# Altium project Dimmer_WiFi.PrjPcb
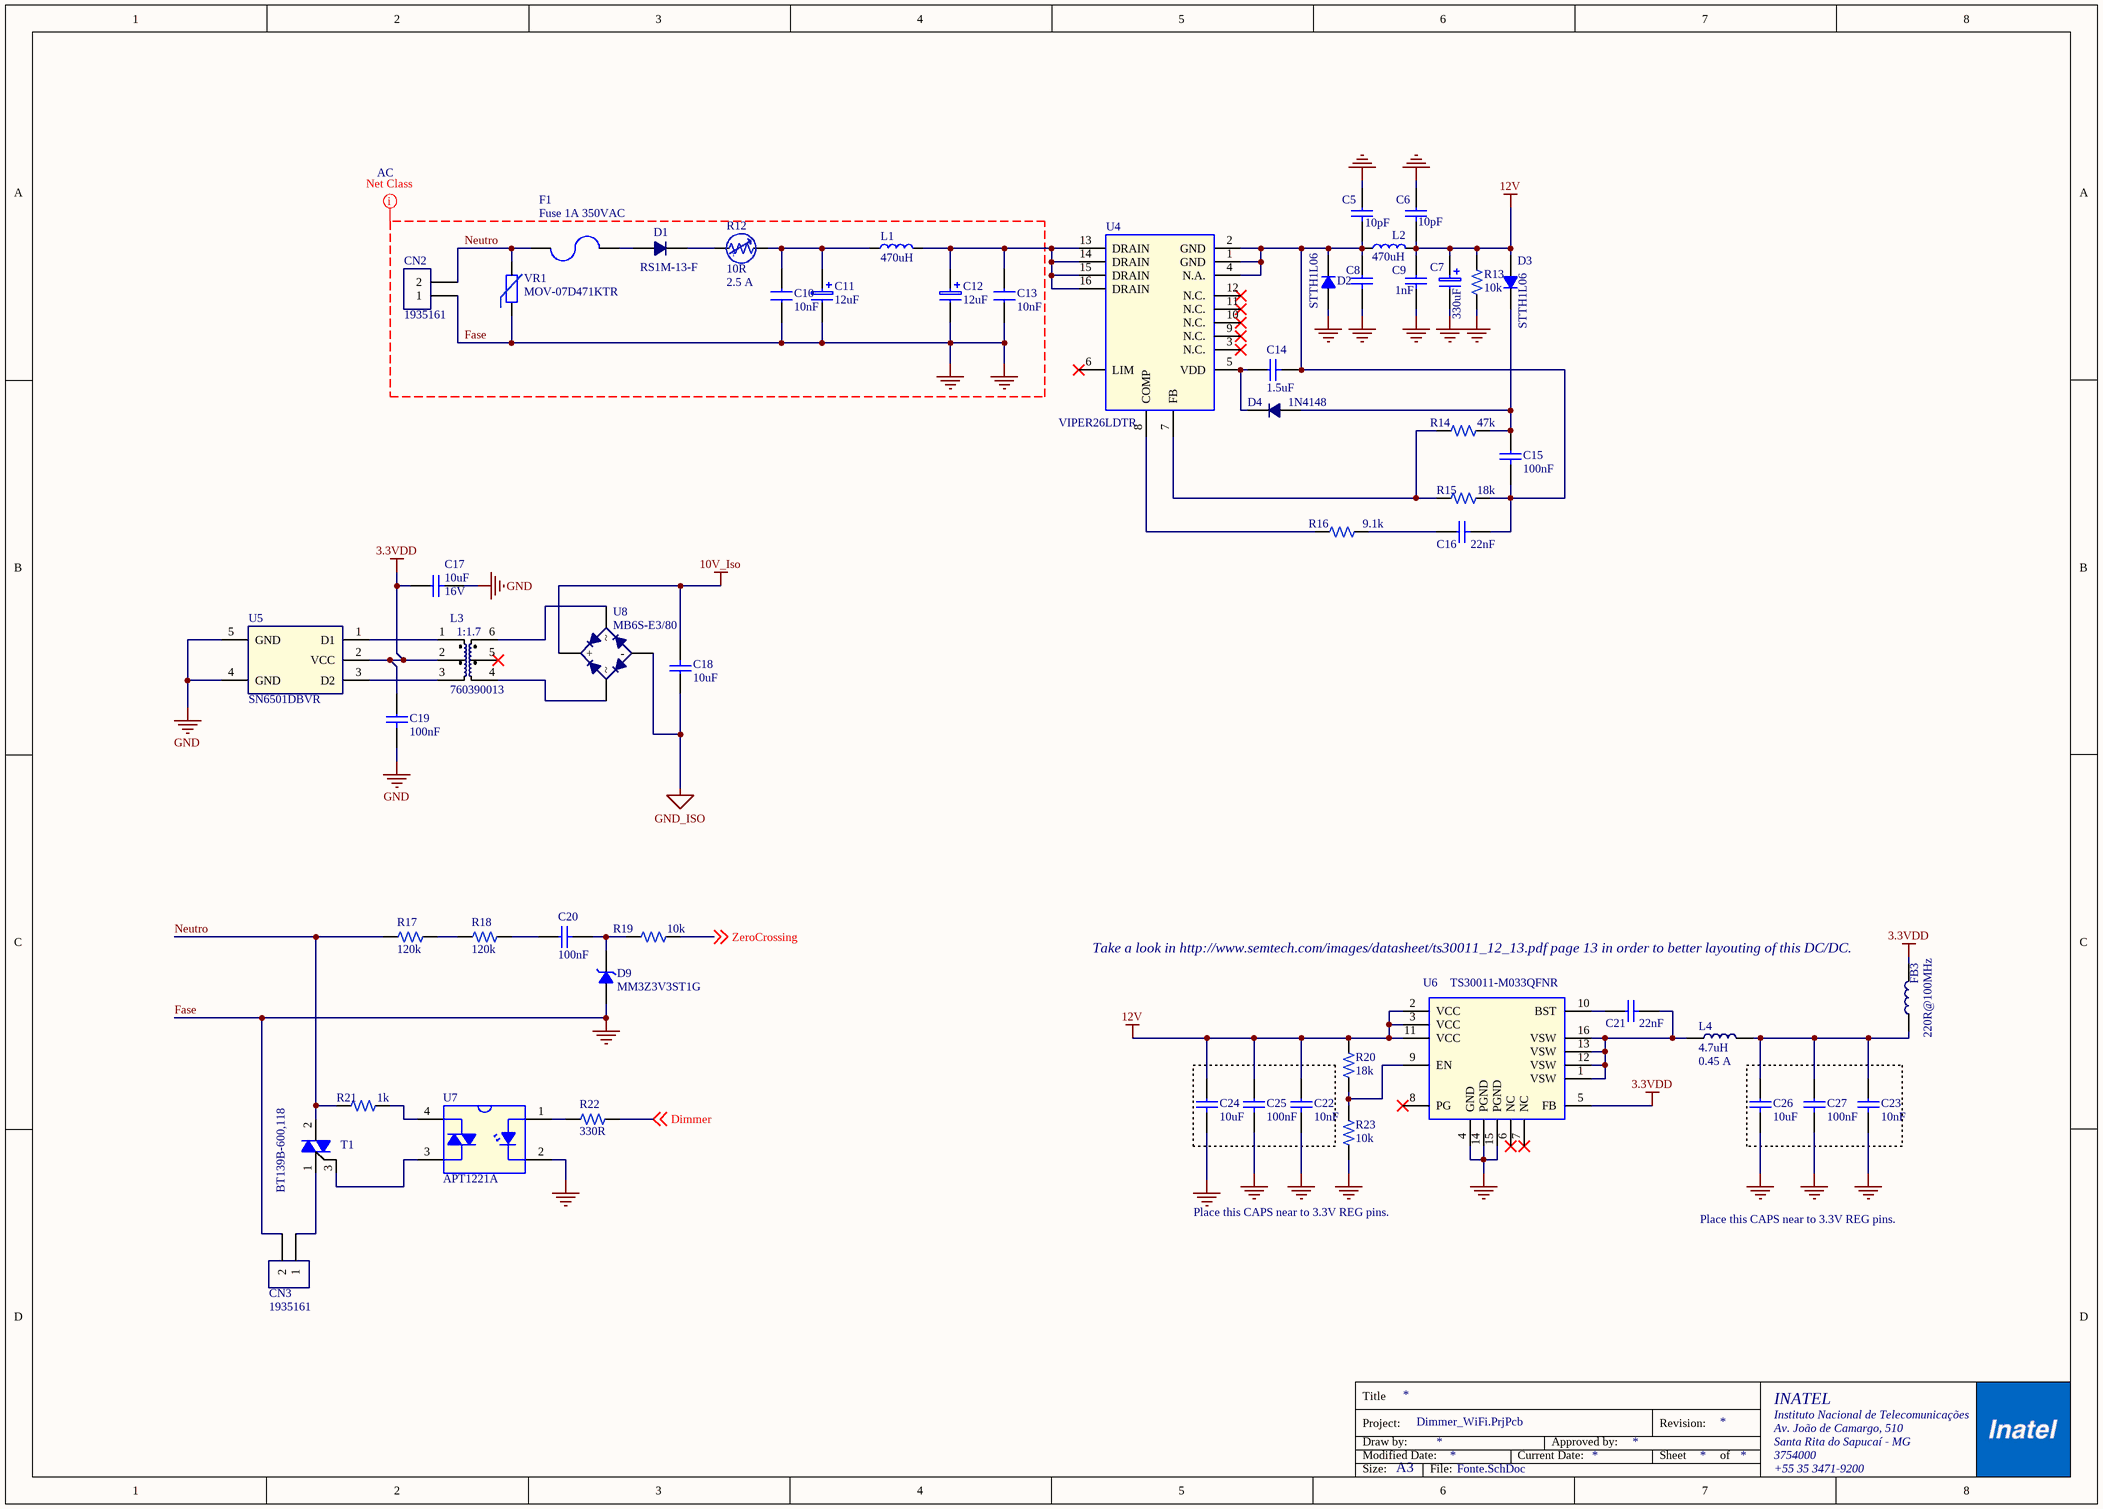
[diagram p0: Fonte.SchDoc]
3 sheets, 95 parts. Net scope: global (net labels, ports and power ports of the same name join across sheets).
Board file: Dimmer_WiFi.PcbDoc
Sheets:
  Fonte.SchDoc
  ESP8266.SchDoc
  DALI.SchDoc

## Sheet Fonte.SchDoc
size A3

### Parts
C5  10pF  [0603-3D]
C6  10pF  [0603-3D]
C7  330uF  [CAP-RADIAL-630Dx1500Hx250P-3D]
C8  1nF  [0603-3D]  (value not drawn)
C9  1nF  [0603-3D]
C10  value 10nF  [CAP-RADIAL-5mm]  (hidden comment: CAP FILM 10000PF 5% 630VDC RAD)
C11  12uF  [CAP-RADIAL-1000Dx1750Hx500P-3D]
C12  12uF  [CAP-RADIAL-1000Dx1750Hx500P-3D]
C13  value 10nF  [CAP-RADIAL-5mm]  (hidden comment: CAP FILM 10000PF 5% 630VDC RAD)
C14  1.5uF  [1206-Ceramic-3D]
C15  100nF  [0603-3D]
C16  22nF  [0603-3D]
C17  Voltage: 16V  [CAP-0603-3D]  (hidden comment: 10uF)
C18  10uF  [CAP-0603-3D]
C19  100nF  [0603-3D]
C20  100nF  [0603-3D]
C21  22nF  [0603-3D]
C22  10nF  [0603-3D]
C23  10nF  [0603-3D]
C24  10uF  [CAP-0603-3D]
C25  100nF  [0603-3D]
C26  10uF  [CAP-0603-3D]
C27  100nF  [0603-3D]
CN2  1935161  [TERM BLOCK PCB 2POS 5.0MM]
CN3  1935161  [TERM BLOCK PCB 2POS 5.0MM]
D1  value RS1M-13-F  [DO-214AC_SMA-3D]  (hidden comment: DIODE GEN PURP 1KV 1A SMA)
D2  STTH1L06  [DO-214AC_SMA-3D]
D3  STTH1L06  [DO-214AC_SMA-3D]
D4  1N4148  [SOD323-3D]
D9  MM3Z3V3ST1G  [SOD323-3D]
F1  Fuse 1A 350VAC  [Fuse-SMD-610L254W279H-3D]
FB3  220R@100MHz  [IND-0603-3D]
L1  470uH  [IND_620W590L450H_CLF6045]
L2  470uH  [IND_620W590L450H_CLF6045]
L3  value 760390013  [TRAFO-DC/DC-CONVERTERS-3D]  (hidden comment: TRANSFORMER 475UH SMD)
L4  value 4.7uH  Current Rating: 0.45 A  [IND-1210-PWR-3D]  (hidden comment: FIXED IND 4.7UH 450MA 200 MOHM)
R12  Current: 2.5 A  [NTC-800D500W-500P-3D]  (hidden comment: 10R)
R13  10k  [0603-3D]
R14  47k  [0603-3D]
R15  18k  [0603-3D]
R16  9.1k  [0603-3D]
R17  120k  [RES-1206-3D]
R18  120k  [RES-1206-3D]
R19  10k  [0603-3D]
R20  18k  [0603-3D]
R21  1k  [0805-3D]
R22  value 330R  [0603-3D]  (hidden comment: RES SMD 330 OHM 5% 1/10W 0603)
R23  10k  [0603-3D]
T1  value BT139B-600,118  [D2PAC-3D]  (hidden comment: TRIAC 600V 16A D2PAK)
U4  VIPER26LDTR  [SO16N-3D]
U5  value SN6501DBVR  [SOT23-5]  (hidden comment: IC REG CONV PWR SUPPLIES SOT23-5)
U6  TS30011-M033QFNR  [16VQFN-3D]
U7  APT1221A  [DIP4-SMD]
U8  value MB6S-E3/80  [TO-269AA-3D]  (hidden comment: Bridge Rectifier Single Phase 600V 500mA Surface Mount TO-269AA (MBS))
VR1  MOV-07D471KTR  [VAR-05D-SERIES-PTH-3D]

### Nets
3.3VDD: C17.1 C19.1 FB3.2 L3.2 U5.2(VCC) U6.5(FB)
10V_Iso: C18.2 U8.3(+)
12V: C6.2 C7.1 C9.1 C22.1 C24.1 C25.1 D3.1 L2.2 R13.2 R20.2 U6.2(VCC) U6.3(VCC) U6.11(VCC)
Fase: C5.1 C6.1 C7.2 C8.2 C9.2 C10.2 C11.2 C12.2 C13.2 C17.2 C19.2 C22.2 C23.2 C24.2 C25.2 C26.2 C27.2 CN2.1 CN3.2 D2.1 D9.1 R13.1 R23.1 U5.4(GND) U5.5(GND) U6.4(GND) U6.14(PGND) U6.15(PGND) U7.2(K) VR1.1  [also labelled GND]
GND_ISO: C18.1 U8.4(-)
Dimmer: R22.2 ; off-sheet Dimmer
Neutro: CN2.2 F1.2 R17.1 R21.2 T1.2(T2) VR1.2
ZeroCrossing: R19.2 ; off-sheet ZeroCrossing
NetC5_2: C5.2 C8.1 C14.2 C15.2 C16.2 D2.2 L2.1 R15.2 U4.1(GND) U4.2(GND) U4.4(N.A.)
NetC10_1: C10.1 C11.1 L1.1 R12.2
NetC12_1: C12.1 C13.1 L1.2 U4.13(DRAIN) U4.14(DRAIN) U4.15(DRAIN) U4.16(DRAIN)
NetC14_1: C14.1 D4.2 U4.5(VDD)
NetC15_1: C15.1 D3.2 D4.1 R14.2
NetC16_1: C16.1 R16.2
NetC20_1: C20.1 R18.2
NetC20_2: C20.2 D9.2 R19.1
NetC21_1: C21.1 U6.10(BST)
NetC21_2: C21.2 L4.1 U6.1(VSW) U6.12(VSW) U6.13(VSW) U6.16(VSW)
NetC23_1: C23.1 C26.1 C27.1 FB3.1 L4.2
NetCN3_1: CN3.1 T1.1(T1)
NetD1_1: D1.1 F1.1
NetD1_2: D1.2 R12.1
NetL3_1: L3.1 U5.1(D1)
NetL3_3: L3.3 U5.3(D2)
NetL3_4: L3.4 U8.1
NetL3_6: L3.6 U8.2
NetR14_1: R14.1 R15.1 U4.7(FB)
NetR16_1: R16.1 U4.8(COMP)
NetR17_2: R17.2 R18.1
NetR20_1: R20.1 R23.2 U6.9(EN)
NetR21_1: R21.1 U7.4(T2)
NetR22_1: R22.1 U7.1(A)
NetT1_3: T1.3(G) U7.3(MT2)

Not connected (* = marked no-connect by the designer): L3 5*; U4 3(N.C.)* 6(LIM)* 9(N.C.)* 10(N.C.)* 11(N.C.)* 12(N.C.)*; U6 6(NC)* 7(NC)* 8(PG)*

### Layout directives
net class AC: (no net found under the mark)

### Notes on the sheet
- (near FB3) Take a look in http://www.semtech.com/images/datasheet/ts30011_12_13.pdf page 13 in order to better layouting of this DC/DC.
- Place this CAPS near to 3.3V REG pins.
- Title
- Modified Date:
- Project:
- Draw by:
- Current Date:
- Approved by:
- Sheet
- Revision:
- of
- Instituto Nacional de Telecomunicações
- Av. João de Camargo, 510
- Santa Rita do Sapucaí - MG
- 3754000
- INATEL
- Size:
- A3
- File:
- +55 35 3471-9200
- (in symbol 760390013 TRANSFORMER 475UH SMD) 1:1.7
- (in symbol SL08 10002 NTC 10R 20% 2.5A 8MM) T

### Library data of the parts
C5 C6 = 10pF 1% 0603 MLCC NPO 50V: CAP CER 10PF 50V NP0 0603; User: Rodrigo Villela; Code: *; Creation Date: 2015/12/01; Version: V01; Size: 0603; Voltage: 50V; Supplier 1: Digi-Key; Value: 10pF; Supplier Part Number 1: 1276-2152-1-ND
C7 = 330uF 20% RADIAL PTH 16V: CAP 330 UF 20% 16 V; User: Jean Pierre; Voltage: 16V; Code: *; Creation Date: 2016/07/08; Version: V01; Size: RADIAL, CAN - PTH; Supplier 1: Digi-Key; Supplier Part Number 1: 732-9474-1-ND; Value: 330uF
C8 C9 = 1000pF 5% 0603 MLCC NP0 50V: CAP CER 1000PF 50V 5% NP0 0603; User: Anderson Daniel Soares; Code: *; Creation Date: 2015/01/27; Version: V01; Supplier 1: Digi-Key; Supplier Part Number 1: 490-4768-1-ND; Voltage: 50V; Size: 0603; Value: 1nF
C10 C13 = 10nF 5% RADIAL FILM 400VAC: User: Ricardo Dias; Voltage: 400VAC; Code: *; Creation: 2016/02/19; Version: V01; Size: Radial; Supplier 1: Digi-Key; Supplier Part Number 1: 495-1262-ND
C11 C12 = 12uF 20% RADIAL PTH 350V: CAP ALUM 12UF 20% 350V RADIAL; User: Ricardo Dias; Code: *; Creation Date: 2016/06/08; Version: V01; Size: RADIAL, CAN - PTH; Voltage: 350V; Supplier 1: Digi-Key; Supplier Part Number 1: 565-3506-ND; Value: 12uF
C14 = 1.5uF 10% 1206 MLCC X7R 50V: CAP CER 1.5UF 50V X7R 1206; User: Ricardo Dias; Code: *; Creation Date: 2016/06/08; Version: V01; Size: 1206; Voltage: 50V; Supplier 1: Digi-Key; Supplier Part Number 1: 445-6985-1-ND; Value: 1.5uF
C15 = 0.1uF 10% 0603 MLCC X7R 50V KEMET: 0.1µF ±10% 50V Ceramic Capacitor X7R 0603 (1608 Metric); User: Ricardo Dias; Code: *; Creation Date: 2017/10/06; Version: V01; Size: 0603; Voltage: 50V; Supplier 1: Digi-Key; Supplier 2: Mouser; Supplier 3: Newark; Supplier Part Number 1: 399-5089-1-ND; Supplier Part Number 2: 80-C0603C104K5R; Supplier Part Number 3: 72J5992; Value: 100nF
C16 C21 = 0.022uF 20% 0603 MLCC X7R 16V: 0.022µF 16V Ceramic Capacitor X7R 0603; User: Jean Pierre; Code: *; Creation Date: 2016/08/16; Supplier 1: Digi-Key; Supplier Part Number 1: 445-5115-1-ND; Size: 0603; Voltage: 16V; Value: 22nF
C17 C18 C24 C26 = 10uF 20% 0603 MLCC X5R 16V: CAP CER 10UF 16V 20% X5R 0603; User: Mateus Elias; Code: *; Creation Date: 2014/10/07; Supplier 1: Digi-Key; Supplier 2: Mouser; Supplier 3: Newark; Supplier Part Number 1: 490-7201-1-ND; Supplier Part Number 2: 963-EMK107BBJ106MA-T; Supplier Part Number 3: 68X2787; Version: V01; Size: 0603; Value: 10uF
  C18 C24 C26: Voltage: 16V
C19 C20 C25 C27 = 0.1uF 10% 0603 MLCC X7R 50V: CAP CER 0.1UF 50V 10% X7R 0603; User: Anderson Daniel Soares; Code: *; Creation Date: 2015/01/23; Version: V01; Supplier 1: Digi-Key; Supplier Part Number 1: 445-5666-6-ND; Supplier 2: Mouser; Supplier Part Number 2: 810-CGA3E2X7R1H104K; Supplier 3: Newark; Supplier Part Number 3: 04X3156; Size: 0603; Voltage: 50V; Value: 100nF
C22 C23 = 10000pF 10% 0603 MLCC X7R 50V KEMET: 10000pF ±10% 16V Ceramic Capacitor X7R 0603 (1608 Metric); User: Ricardo Dias; Voltage: 50V; Code: *; Creation Date: 2017/10/06; Version: V01; Size: 0603; Supplier 1: Digi-Key; Supplier 2: Mouser; Supplier Part Number 1: 399-7841-1-ND; Supplier Part Number 2: 80-C0603C103K4R; Value: 10nF
CN2 CN3 = 1935161  TERM BLOCK PCB 2X1: TERM BLOCK PCB 2POS 5.0MM; User: Rodrigo Balbi; Code: *; Creation Date: 2015/11/30; Size: -; Version: V02; Supplier 1: Digikey; Supplier Part Number 1: 277-1667-ND; Supplier 2: Mouser; Supplier 3: Newarc; Supplier Part Number 2: 651-1935161; Supplier Part Number 3: 70R0063; Value: 1935161
D1 = RS1M-13-F DIODE GEN PURP 1KV 1A SMA: Manufacturer: Diodes Incorporated; User: Pedro Vilela; Size: DO-214AC, SMA; Code: *; Creation Date: 2018/09/28; Version: V03; Supplier 1: Digi-Key; Supplier 2: Mouser; Supplier 3: Newark; Supplier Part Number 2: 621-RS1M-13-F; Supplier Part Number 3: 23T8374; Supplier Part Number 1: RS1M-FDICT-ND; Manufacturer Part Number: RS1M-13-F; ComponentLink1Description: RS1M-FDICT-ND; ComponentLink1URL: https://www.digikey.com/products/en?keywords=RS1M-FDICT-ND
D2 D3 = STTH1L06 TURBO 2 ULTRAFAST HIGH VOLTAGE RECTIFIER: DIODE GEN PURP 600V 1A SMA; User: Rafael Magalhães de Barros; Code: *; Creation Date: 2016/02/26; Size: SMA; Version: V01; Supplier 1: Digi-Key; Supplier Part Number 1: 497-3241-1-ND; Supplier 2: Mouser; Supplier Part Number 2: 511-STTH1L06A; Value: STTH1L06
D4 = 1N4148 FAST SWITCHING DIODE: DIODE SWITCHING 75V 0.15A SOD323; User: Mateus Elias; Code: *; Creation Date: 2014/10/27; Size: SOD323; Supplier 1: Digi-Key; Supplier 2: Mouser; Supplier 3: Newark; Supplier Part Number 1: 1N4148WS-E3-08CT-ND; Supplier Part Number 2: 78-1N4148WS-E3-08; Supplier Part Number 3: 35K9699; Version: V01; Value: 1N4148
D9 = MM3Z3V3ST1G 3.3V DIODE ZENER: DIODE ZENER 3.3V 200MW SOD323; User: Ricardo Dias; Code: *; Creation Date: 2016/06/07; Size: SOD323; Version: V01; Supplier 1: Digi-Key; Supplier Part Number 1: MM3Z3V3ST1GOSCT-ND; Value: MM3Z3V3ST1G
F1 = Fuse Board SMD2410 350VAC 72VDC: FUSE BOARD MNT 1A 350VAC 72VDC; User: Mateus Elias; Code: *; Creation Date: 2015/11/23; Size: 610L254W279H; Version: V01; Supplier 1: Digi-Key; Supplier Part Number 1: 507-2046-1-ND; Value: Fuse 1A 350VAC
FB3 = 220R@100MHz 0603 FB 0.05R 2A: FERRITE CHIP 0603 220 OHM; User: Jean Pierre; Current Rating: 2A; Code: *; Creation Date: 2015/05/05; Version: V01; Size: 0603; Supplier 1: Digi-Key; Supplier Part Number 1: 445-1565-1-ND; Value: 220R@100MHz
L1 L2 = 470uH 20% SMDPWR WW 0.37A: FIXED IND 470UH 370MA 1.42 OHM; User: Jean Pierre; Code: *; Creation Date: 2016/07/11; Version: V01; Size: 6.2mm x 5.9mm  x 4.5mm; Current Rating: 370 mA; Supplier 1: Digi-Key; Supplier Part Number 1: 445-15102-1-ND; Value: 470uH
L3 = 760390013 TRANSFORMER 475UH SMD: User: Ricardo Dias; Code: *; Creation Date: 2017/09/06; Version: V01; Size: 0603; Supplier 1: Digi-Key; Supplier 2: Mouser; Supplier Part Number 1: 732-4457-1-ND; Supplier Part Number 2: 710-760390013
L4 = 4.7uH SMD WW 0.2R 0.45A: User: Jean Pierre; Code: *; Creation Date: 2015/05/11; Version: V01; Size: 320L250W170H; Supplier 1: Digi-Key; Supplier Part Number 1: 490-2495-1-ND
R12 = SL08 10002 NTC 10R 20% 2.5A 8MM: ICL 10 OHM 20% 2.5A 8MM; User: Jean Pierre; Code: *; Creation Date: 2016/09/23; Version: V01; Size: 800D500W; Tolerance: 20%; Supplier 1: Digi-Key; Supplier Part Number 1: 570-1094-ND; Value: 10R
R13 R19 R23 = 10k 1% 0603 TNF 1/10W: RES SMD 10K OHM 1% 1/10W 0603; Manufacturer: Yageo; Manufacturer Part Number: RC0603FR-0710KL; User: Pedro Vilela; Code: *; Creation Date: 2018/09/28; Version: V03; Size: 0603; Supplier 1: Digi-Key; Supplier 2: Mouser; Supplier 3: Newark; Supplier Part Number 1: 311-10.0KHRCT-ND; Supplier Part Number 2: 603-RC0603FR-0710KL; Supplier Part Number 3: 68X3181; Tolerance: 1%; ComponentLink1Description: 311-10.0KHRCT-ND; ComponentLink1URL: https://www.digikey.com/products/en?keywords=311-10.0KHRCT-ND; Value: 10k
R14 = 47k 1% 0603 TKF 1/16W: RES SMD 47K OHM 1% 1/10W 0603; User: Anderson Daniel Soares; Code: *; Creation Date: 2015/01/27; Supplier Link 1: http://www.digikey.com/product-search/en?pv7=2&k=311-47.0KHRCT-ND&mnonly=0&newproducts=0&ColumnSort=0&page=1&stock=1&quantity=0&ptm=0&fid=0&pageSize=25; Supplier Link 2: http://br.mouser.com/ProductDetail/Panasonic/ERJ-3EKF4702V/?qs=%2fha2pyFadujWqMGonbcVXdO432yyH%2fwnIoCZHha2gphIl1D2ssXdow%3d%3d; Supplier Link 3: http://www.newark.com/panasonic-electronic-components/erj-3ekf4702v/thick-film-resistor-47kohm-100mw/dp/64R5350?ost=64R5350; Version: V01; Supplier 1: Digi-Key; Supplier Part Number 1: 311-47.0KHRCT-ND; Supplier 2: Mouser; Supplier Part Number 2: 667-ERJ-3EKF4702V; Supplier 3: Newark; Supplier Part Number 3: 64R5350; Size: 0603; Value: 47k
R15 R20 = 18k 1% 0603 TKF 1/10W: RES SMD 18K OHM 1% 1/10W 0603; User: Ricardo Dias; Creation Date: 2015/06/16; Version: V01; Size: 0603; Supplier 1: Digi-Key; Supplier Part Number 1: 1276-4765-1-ND; Value: 18k; Tolerance: 1%
R16 = 9.1k 1% 0603 TKF 1/10W: RES SMD 9.1K OHM 1% 1/10W 0603; User: Ricardo Dias; Creation Date: 2015/06/10; Version: V01; Size: 0603; Supplier 1: Digi-Key; Supplier Part Number 1: RHM9.1KCLDKR-ND; Value: 9.1k
R17 R18 = 120k 5% 1206 TKF 1/4W: RES SMD 120K OHM 5% 1/4W 1206; User: Rodrigo Villela; Code: *; Creation Date: 19/11/2016; Version: V01; Size: 1206; Tolerance: 5%; Supplier 1: Digi-Key; Value: 120k; Supplier Part Number 1: 311-120KERDKR-ND
R21 = 1k 1% 0805 TKF 1/8W: RES SMD 1K OHM 1% 1/8W 0805; User: Mateus Elias; Code: *; Creation Date: 2015/10/14; Supplier Link 1: http://www.digikey.com/product-detail/en/RC0805FR-071KL/311-1.00KCRCT-ND/730391; Version: V01; Supplier 1: Digi-Key; Supplier Part Number 1: 311-1.00KCRCT-ND; Size: 0805; Value: 1k
R22 = 330R 5% 0603 TKF 1/10W: User: Luiz F Siecola; Code: *; Creation Date: 2017/05/03; Version: V02; Size: 0603; Supplier 1: Digi-Key; Supplier Part Number 1: P330GCT-ND; Tolerance: 5%; Supplier 2: Mouser; Supplier 3: Newark; Supplier Part Number 2: 667-ERJ-3GEYJ331V; Supplier Part Number 3: 65T8629
T1 = BT139B-600,118 TRIAC GEN PURPOSE: User: Jean Pierre; Size: D2PAK, TO-263; Code: *; Creation Date: 2016/06/03; Version: V01; Supplier 1: Digi-Key; Supplier Part Number 1: 568-12230-1-ND
U4 = VIPER26LDTR CONVERTER CA/CC FIXED FREQ: IC OFFLINE CONV PWM 800V 16-SOIC; User: Ricardo Dias; Code: *; Creation Date: 2016/05/25; Size: SOIC16; Version: V01; Supplier 1: Digi-Key; Supplier Part Number 1: VIPER26LDCT-ND; Value: VIPER26LDTR
U5 = SN6501DBVR REG CONV ISO PWR SUPPLIES SOT23-5: User: Ricardo Dias; Code: *; Creation Date: 20150610; Size: SOT23-5; Version: V01; Supplier 1: Digi-Key; Supplier 2: Mouser; Supplier Part Number 1: 296-37700-6-ND; Supplier Part Number 2: 595-SN6501DBVR
U6 = TS30011-M033QFNR DC/DC 3.3V FIX 1A 1.5MHz: IC REG BUCK 3.3V 1A SYNC 16-VQFN; User: Ricardo Dias; Code: *; Creation Date: 2016/06/09; Size: 16VQFN; Version: V01; Value: TS30011-M033QFNR; Supplier 1: Digi-Key; Supplier Part Number 1: TS30011-M033QFNRCT-ND
U7 = APT1221A: Optoisolator Triac Output 5000Vrms 1 Channel 4-SMD; User: Luiz Fernando; Code: *; Creation Date: 2017/02/01; Version: V01; Supplier 1: Digi-Key; Supplier Part Number 1: 255-1522-5-ND; Value: APT1221A
U8 = MB6S-E3/80 BRIDGE RECTIFIER SINGLE: User: Reis; Creation Date: 2017/05/08; Descrition: Bridge Rectifier Single Phase 600V 500mA Surface Mount TO-269AA (MBS); Size: TO-269AA (MBS); Supplier 1: Digi-Key; Code: *; Version: V0.2; Supplier 2: Mouser; Supplier 3: Newark; Supplier Part Number 1: MB6S-E3/80GICT-ND; Supplier Part Number 2: 625-MB6S-E3/80; Supplier Part Number 3: 75R2117
VR1 = MOV-07D471KTR VAR 470V 1.2KA DISC 7MM: MOV-07D471KTR - VARISTOR 470V 1.2KA DISC 7MM; User: Luiz F Siecola; Code: *; Creation Date: 2017/08/30; Size: 400W800L1100H; Supplier 1: Digi-Key; Supplier 2: Mouser; Supplier 3: Newark; Supplier Part Number 1: MOV-07D471KTRCT-ND; Supplier Part Number 2: 652-MOV-07D471KTR; Version: V01; Value: MOV-07D471KTR

## Sheet ESP8266.SchDoc
size A3
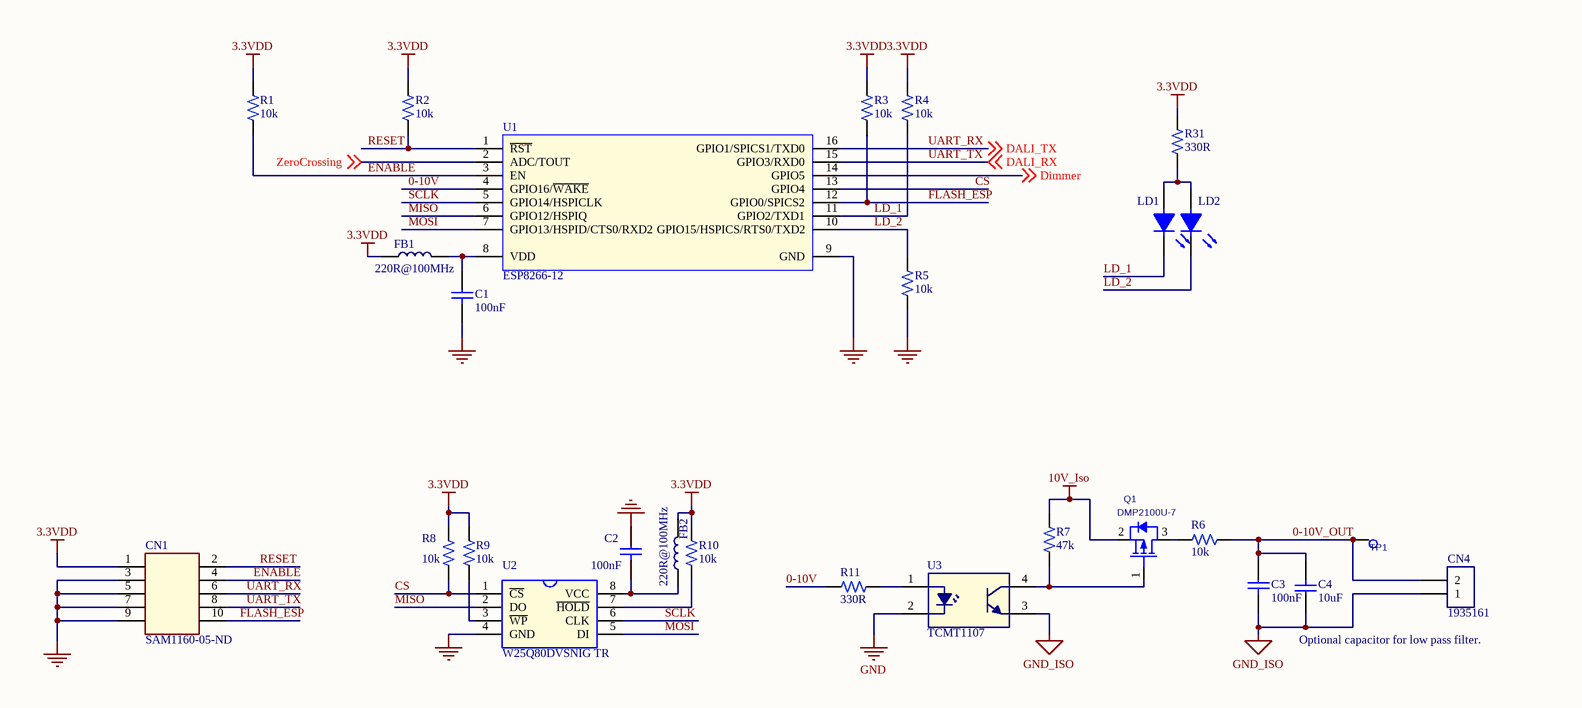
[diagram p1: ESP8266.SchDoc]

### Parts
C1  100nF  [0603-3D]
C2  100nF  [0603-3D]
C3  100nF  [0603-3D]
C4  10uF  [CAP-0603-3D]
CN1  SAM1160-05-ND  [CON-SMD-MINITEK-H-2X5-127P]
CN4  1935161  [TERM BLOCK PCB 2POS 5.0MM]
FB1  220R@100MHz  [IND-0603-3D]
FB2  220R@100MHz  [IND-0603-3D]
LD1  LG R971-KN-1  [GREEN-LED-0805-3D]  (value not drawn)
LD2  LS R976-NR-1  [RED-LED-0805-3D]  (value not drawn)
Q1  value DMP2100U-7  [SOT23-3D]  (hidden comment: MOSFET P CH 20V 4.3A SOT23)
R1  10k  [0603-3D]
R2  10k  [0603-3D]
R3  10k  [0603-3D]
R4  10k  [0603-3D]
R5  10k  [0603-3D]
R6  10k  [0603-3D]
R7  47k  [0603-3D]
R8  10k  [0603-3D]
R9  10k  [0603-3D]
R10  10k  [0603-3D]
R11  value 330R  [0603-3D]  (hidden comment: RES SMD 330 OHM 5% 1/10W 0603)
R31  value 330R  [0603-3D]  (hidden comment: RES SMD 330 OHM 5% 1/10W 0603)
TP1  MECH TESTPOINT 1mm  [Fiducial smd 1mm]  (value not drawn)  (no BOM)
U1  ESP8266-12  [ESP8266-14-3D]
U2  W25Q80DVSNIG TR  [SOIC8-3D]
U3  TCMT1107  [SOP4]

### Nets
3.3VDD: CN1.1 FB1.1 FB2.2 R1.2 R2.2 R3.2 R4.2 R8.2 R9.2 R10.2 R31.2
10V_Iso: Q1.2(S) R7.2
GND: C1.2 C2.1 CN1.3 CN1.5 CN1.7 CN1.9 R5.1 U1.9(GND) U2.4(GND) U3.2(K)  [project net Fase]
GND_ISO: C3.2 C4.1 CN4.1 U3.3(E)
0-10V: R11.1 U1.4(GPIO16/~{WAKE})
0-10V_OUT: C3.1 C4.2 CN4.2 R6.1 TP1.1
CS: R8.1 U1.13(GPIO4) U2.1(~{CS})
Dimmer: U1.14(GPIO5) ; off-sheet Dimmer
ENABLE: CN1.4 R1.1 U1.3(EN)
FLASH_ESP: CN1.10 R3.1 U1.12(GPIO0/SPICS2)
LD_1: LD1.2(CATODE) R4.1 U1.11(GPIO2/TXD1)
LD_2: LD2.2(CATODE) R5.2 U1.10(GPIO15/HSPICS/RTS0/TXD2)
MISO: U1.6(GPIO12/HSPIQ) U2.2(DO)
MOSI: U1.7(GPIO13/HSPID/CTS0/RXD2) U2.5(DI)
RESET: CN1.2 R2.1 U1.1(~{RST})
SCLK: U1.5(GPIO14/HSPICLK) U2.6(CLK)
UART_RX: CN1.6 U1.16(GPIO1/SPICS1/TXD0) ; off-sheet DALI_TX  [also labelled DALI_TX]
UART_TX: CN1.8 U1.15(GPIO3/RXD0) ; off-sheet DALI_RX  [also labelled DALI_RX]
ZeroCrossing: U1.2(ADC/TOUT) ; off-sheet ZeroCrossing
NetC1_1: C1.1 FB1.2 U1.8(VDD)
NetC2_2: C2.2 FB2.1 U2.8(VCC)
NetLD1_1: LD1.1(ANODE) LD2.1(ANODE) R31.1
NetQ1_1: Q1.1(G) R7.1 U3.4(C)
NetQ1_3: Q1.3(D) R6.2
NetR9_1: R9.1 U2.3(~{WP})
NetR10_1: R10.1 U2.7(~{HOLD})
NetR11_2: R11.2 U3.1(A)

### Notes on the sheet
- Optional capacitor for low pass filter.
- Title
- Modified Date:
- Project:
- Draw by:
- Current Date:
- Approved by:
- Sheet
- Revision:
- of
- Instituto Nacional de Telecomunicações
- Av. João de Camargo, 510
- Santa Rita do Sapucaí - MG
- 3754000
- INATEL
- Size:
- A3
- File:
- +55 35 3471-9200

### Library data of the parts
C1-C3 = 0.1uF 10% 0603 MLCC X7R 50V: as C19 on sheet Fonte; Code: *; Creation Date: 2015/01/23; Version: V01; Supplier 1: Digi-Key; Supplier Part Number 1: 445-5666-6-ND; Supplier 2: Mouser; Supplier Part Number 2: 810-CGA3E2X7R1H104K; Supplier 3: Newark; Supplier Part Number 3: 04X3156; Size: 0603; Voltage: 50V; Value: 100nF
C4 = 10uF 20% 0603 MLCC X5R 16V: as C17 on sheet Fonte; Code: *; Creation Date: 2014/10/07; Supplier 1: Digi-Key; Supplier 2: Mouser; Supplier 3: Newark; Supplier Part Number 1: 490-7201-1-ND; Supplier Part Number 2: 963-EMK107BBJ106MA-T; Supplier Part Number 3: 68X2787; Version: V01; Size: 0603; Value: 10uF; Voltage: 16V
CN1 = SAM1160-05-ND CN HDR 5X2 1.27mm 90°: 10 Positions Header, Unshrouded Connector 0.050" (1.27mm) Surface Mount, Right Angle Gold; User: Jean Pierre; Code: *; Creation Date: 2016/09/19; Size: 5X2 1.27mm SMD; Supplier 1: Digi-Key; Supplier Part Number 1: SAM1160-05-ND; Version: V01; Value: SAM1160-05-ND
CN4 = 1935161  TERM BLOCK PCB 2X1: as CN2 on sheet Fonte; Code: *; Creation Date: 2015/11/30; Size: -; Version: V02; Supplier 1: Digikey; Supplier Part Number 1: 277-1667-ND; Supplier 2: Mouser; Supplier 3: Newarc; Supplier Part Number 2: 651-1935161; Supplier Part Number 3: 70R0063; Value: 1935161
FB1 FB2 = 220R@100MHz 0603 FB 0.05R 2A: as FB3 on sheet Fonte; Code: *; Creation Date: 2015/05/05; Version: V01; Size: 0603; Supplier 1: Digi-Key; Supplier Part Number 1: 445-1565-1-ND; Value: 220R@100MHz
LD1 = LED GREEN DIFFUSED 0805 SMD: Green 570nm LED Indication - Discrete 2.2V 0805 (2012 Metric); User: Reis; Code: *; Creation Date: 2017/03/22; Version: V01; Size: 0805; Supplier 1: Digi-Key; Supplier Part Number 1: 475-1410-1-ND; Value: LG R971-KN-1
LD2 = LED RED DIFFUSED 0805 SMD: Red 633nm LED Indication - Discrete 2V 0805 (2012 Metric); User: Reis; Code: *; Creation Date: 2017/03/23; Version: V01; Size: 0805; Supplier 1: Digi-Key; Supplier Part Number 1: 475-1278-1-ND; Value: LS R976-NR-1
Q1 = DMP2100U-7 MOSFET P-CH: User: Reis; Code: *; Creation Date: 2017/05/08; Size: SOT-23; Version: V03; Supplier 1: Digi-Key; Supplier Part Number 1: DMP2100U-7CT-ND; Supplier 2: Mouser; Supplier 3: Newark; Supplier Part Number 2: 621-DMP2100U-7; Supplier Part Number 3: 82Y6587
R1-R6 R8-R10 = 10k 1% 0603 TNF 1/10W: as R13 on sheet Fonte; Code: *; Creation Date: 2018/09/28; Version: V03; Size: 0603; Supplier 1: Digi-Key; Supplier 2: Mouser; Supplier 3: Newark; Supplier Part Number 1: 311-10.0KHRCT-ND; Supplier Part Number 2: 603-RC0603FR-0710KL; Supplier Part Number 3: 68X3181; Tolerance: 1%; ComponentLink1Description: 311-10.0KHRCT-ND; ComponentLink1URL: https://www.digikey.com/products/en?keywords=311-10.0KHRCT-ND; Value: 10k
R7 = 47k 1% 0603 TKF 1/16W: as R14 on sheet Fonte; Code: *; Creation Date: 2015/01/27; Supplier Link 1: http://www.digikey.com/product-search/en?pv7=2&k=311-47.0KHRCT-ND&mnonly=0&newproducts=0&ColumnSort=0&page=1&stock=1&quantity=0&ptm=0&fid=0&pageSize=25; Supplier Link 2: http://br.mouser.com/ProductDetail/Panasonic/ERJ-3EKF4702V/?qs=%2fha2pyFadujWqMGonbcVXdO432yyH%2fwnIoCZHha2gphIl1D2ssXdow%3d%3d; Supplier Link 3: http://www.newark.com/panasonic-electronic-components/erj-3ekf4702v/thick-film-resistor-47kohm-100mw/dp/64R5350?ost=64R5350; Version: V01; Supplier 1: Digi-Key; Supplier Part Number 1: 311-47.0KHRCT-ND; Supplier 2: Mouser; Supplier Part Number 2: 667-ERJ-3EKF4702V; Supplier 3: Newark; Supplier Part Number 3: 64R5350; Size: 0603; Value: 47k
R11 R31 = 330R 5% 0603 TKF 1/10W: User: Luiz F Siecola; Code: *; Creation Date: 2017/05/03; Version: V02; Size: 0603; Supplier 1: Digi-Key; Supplier Part Number 1: P330GCT-ND; Tolerance: 5%; Supplier 2: Mouser; Supplier 3: Newark; Supplier Part Number 2: 667-ERJ-3GEYJ331V; Supplier Part Number 3: 65T8629
TP1 = MECH TESTPOINT 1mm: Fiducial; User: Larissa; Code: *; Creation Date: 2015/09/10; Size: *; Supplier 1: N/A; Supplier Part Number 1: N/A; Version: V01
U1 = ESP8266-12 Wi-Fi Module: ESP8266 SMT MODULE; User: Ricardo Dias; Code: *; Creation Date: 2016/05/31; Size: LLC; Version: V01; Value: ESP8266-12
U2 = W25Q80DVSNIG TR IC FLASH 8MBIT: IC FLASH 8MBIT 104MHZ 8SOIC; User: Ricardo Dias; Code: *; Creation Date: 2016/06/07; Size: SOIC8; Version: V01; Supplier 1: Digi-Key; Supplier Part Number 1: W25Q80DVSNIG CT-ND; Value: W25Q80DVSNIG TR
U3 = TCMT1107 OPTO TRANS: OPTOISOLATOR 3.75KV TRANS 4-SOP; User: Jean Pierre; Code: *; Creation Date: 2017/06/23; Size: 4-SOP; Version: V01; Supplier 1: Digi-Key; Supplier 2: Mouser; Supplier 3: Newark; Value: TCMT1107; Supplier Part Number 1: TCMT1107CT-ND; Supplier Part Number 2: 782-TCMT1107; Supplier Part Number 3: 35C2113

## Sheet DALI.SchDoc
size A3
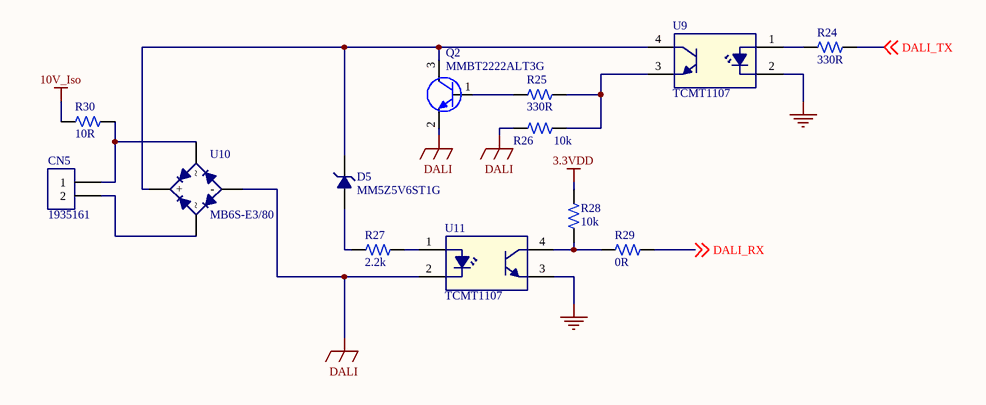
[diagram p2: DALI.SchDoc]

### Parts
CN5  1935161  [TERM BLOCK PCB 2POS 5.0MM]
D5  MM5Z5V6ST1G  [SOD-523-3D]
Q2  MMBT2222ALT3G  [SOT23-3D]
R24  value 330R  [0603-3D]  (hidden comment: RES SMD 330 OHM 5% 1/10W 0603)
R25  value 330R  [0603-3D]  (hidden comment: RES SMD 330 OHM 5% 1/10W 0603)
R26  10k  [0603-3D]
R27  2.2k  [0603-3D]
R28  10k  [0603-3D]
R29  0R  [0603-3D]
R30  10R  [0603-3D]
U9  TCMT1107  [SOP4]
U10  value MB6S-E3/80  [TO-269AA-3D]  (hidden comment: Bridge Rectifier Single Phase 600V 500mA Surface Mount TO-269AA (MBS))
U11  TCMT1107  [SOP4]

### Nets
3.3VDD: R28.1
10V_Iso: R30.1
DALI: Q2.2(E) R26.2 U10.4(-) U11.2(K)
GND: U9.2(K) U11.3(E)  [project net Fase]
DALI_RX: R29.2 ; off-sheet DALI_RX  [project net UART_TX]
DALI_TX: R24.2 ; off-sheet DALI_TX  [project net UART_RX]
NetCN5_1: CN5.1 R30.2 U10.2
NetCN5_2: CN5.2 U10.1
NetD5_1: D5.1 R27.2
NetD5_2: D5.2 Q2.3(C) U9.4(C) U10.3(+)
NetQ2_1: Q2.1(B) R25.1
NetR24_1: R24.1 U9.1(A)
NetR25_2: R25.2 R26.1 U9.3(E)
NetR27_1: R27.1 U11.1(A)
NetR28_2: R28.2 R29.1 U11.4(C)

### Notes on the sheet
- Title
- Modified Date:
- Project:
- Draw by:
- Current Date:
- Approved by:
- Sheet
- Revision:
- of
- Instituto Nacional de Telecomunicações
- Av. João de Camargo, 510
- Santa Rita do Sapucaí - MG
- 3754000
- INATEL
- Size:
- A3
- File:
- +55 35 3471-9200

### Library data of the parts
CN5 = 1935161  TERM BLOCK PCB 2X1: as CN2 on sheet Fonte; Code: *; Creation Date: 2015/11/30; Size: -; Version: V02; Supplier 1: Digikey; Supplier Part Number 1: 277-1667-ND; Supplier 2: Mouser; Supplier 3: Newarc; Supplier Part Number 2: 651-1935161; Supplier Part Number 3: 70R0063; Value: 1935161
D5 = MM5Z5V6ST1G DIODE ZENER 5.61V 500MW: DIODE ZENER 5.61V 500MW SOD523; User: Larissa; Code: *; Creation: 2017/09/12; Size: SOD523; Version: V01; Supplier 1: Digi-Key; Supplier 2: Mouser; Supplier Part Number 1: MM5Z5V6ST1GOSCT-ND; Supplier Part Number 2: 863-MM5Z5V6ST1G; Supplier 3: Farnell; Supplier Part Number 3: 10N9531; Value: MM5Z5V6ST1G
Q2 = MMBT2222ALT3G TRANS NPN SOT23: TRANS NPN 40V 0.6A SOT-23; User: Larissa; Code: *; Creation Date: 2017/09/08; Size: SOT23; Version: V01; Supplier 1: Digi-Key; Supplier Part Number 1: MMBT2222ALT3GOSCT-ND; Supplier 2: Mouser; Supplier 3: Newark; Supplier Part Number 2: 863-MMBT2222ALT3G; Supplier Part Number 3: 10N9478; Value: MMBT2222ALT3G
R24 R25 = 330R 5% 0603 TKF 1/10W: User: Luiz F Siecola; Code: *; Creation Date: 2017/05/03; Version: V02; Size: 0603; Supplier 1: Digi-Key; Supplier Part Number 1: P330GCT-ND; Tolerance: 5%; Supplier 2: Mouser; Supplier 3: Newark; Supplier Part Number 2: 667-ERJ-3GEYJ331V; Supplier Part Number 3: 65T8629
R26 R28 = 10k 1% 0603 TNF 1/10W: as R13 on sheet Fonte; Code: *; Creation Date: 2018/09/28; Version: V03; Size: 0603; Supplier 1: Digi-Key; Supplier 2: Mouser; Supplier 3: Newark; Supplier Part Number 1: 311-10.0KHRCT-ND; Supplier Part Number 2: 603-RC0603FR-0710KL; Supplier Part Number 3: 68X3181; Tolerance: 1%; ComponentLink1Description: 311-10.0KHRCT-ND; ComponentLink1URL: https://www.digikey.com/products/en?keywords=311-10.0KHRCT-ND; Value: 10k
R27 = 2.2k 5% 0603 TKF 1/10W: RES SMD 2.2K OHM 5% 1/10W 0603; User: Rodrigo Balbi; Code: *; Creation Date: 2015/11/10; Supplier Link 1: http://www.digikey.com/product-detail/en/RMCF0805FT2K20/RMCF0805FT2K20CT-ND/1942387; Version: V02; Supplier 1: Digi-Key; Supplier 2: Mouser; Supplier 3: Newarc; Supplier Part Number 1: P2.2KGCT-ND; Supplier Part Number 2: 667-ERJ-3GEYJ222V; Supplier Part Number 3: 65T8604; Size: 0603; Value: 2.2k; Tolerance: 5%
R29 = 0R 0603 TKF 1/10W: RES SMD 0.0OHM JUMPER 1/10W 0603; User: Reis; Creation Date: 2017/04/11; Version: V01; Size: 0603; Supplier 1: Digikey; Supplier 2: Mouser; Supplier 3: Newark; Supplier Part Number 1: 311-0.0GRCT-ND; Supplier Part Number 2: 603-RC0603JR-070RL; Supplier Part Number 3: 74K0306; Value: 0R
R30 = 10R 5% 0603 TKF 1/10W: RES SMD 10 OHM 5% 1/10W 0603; User: Rodrigo Villela; Code: *; Creation Date: 2015/08/26; Version: V01; Size: 0603; Supplier 1: Digi-Key; Supplier Part Number 1: 311-10GRCT-ND; Tolerance: 5%; Value: 10R
U9 U11 = TCMT1107 OPTO TRANS: as U3 on sheet ESP8266; Code: *; Creation Date: 2017/06/23; Size: 4-SOP; Version: V01; Supplier 1: Digi-Key; Supplier 2: Mouser; Supplier 3: Newark; Supplier Part Number 1: TCMT1107CT-ND; Supplier Part Number 2: 782-TCMT1107; Supplier Part Number 3: 35C2113; Value: TCMT1107
U10 = MB6S-E3/80 BRIDGE RECTIFIER SINGLE: User: Reis; Creation Date: 2017/05/08; Descrition: Bridge Rectifier Single Phase 600V 500mA Surface Mount TO-269AA (MBS); Size: TO-269AA (MBS); Supplier 1: Digi-Key; Code: *; Version: V0.2; Supplier 2: Mouser; Supplier 3: Newark; Supplier Part Number 1: MB6S-E3/80GICT-ND; Supplier Part Number 2: 625-MB6S-E3/80; Supplier Part Number 3: 75R2117

## Nets that join several sheets
3.3VDD: Fonte (6 pins), ESP8266 (11 pins), DALI (R28.1)
10V_Iso: Fonte (C18.2 U8.3), ESP8266 (Q1.2 R7.2), DALI (R30.1)
Fase: Fonte (30 pins), ESP8266 (10 pins), DALI (U9.2 U11.3)
GND_ISO: Fonte (C18.1 U8.4), ESP8266 (C3.2 C4.1 CN4.1 U3.3)
Dimmer: Fonte (R22.2), ESP8266 (U1.14)
UART_RX: ESP8266 (CN1.6 U1.16), DALI (R24.2)
UART_TX: ESP8266 (CN1.8 U1.15), DALI (R29.2)
ZeroCrossing: Fonte (R19.2), ESP8266 (U1.2)